# Altium project A540R260_Arm6.PrjPcb
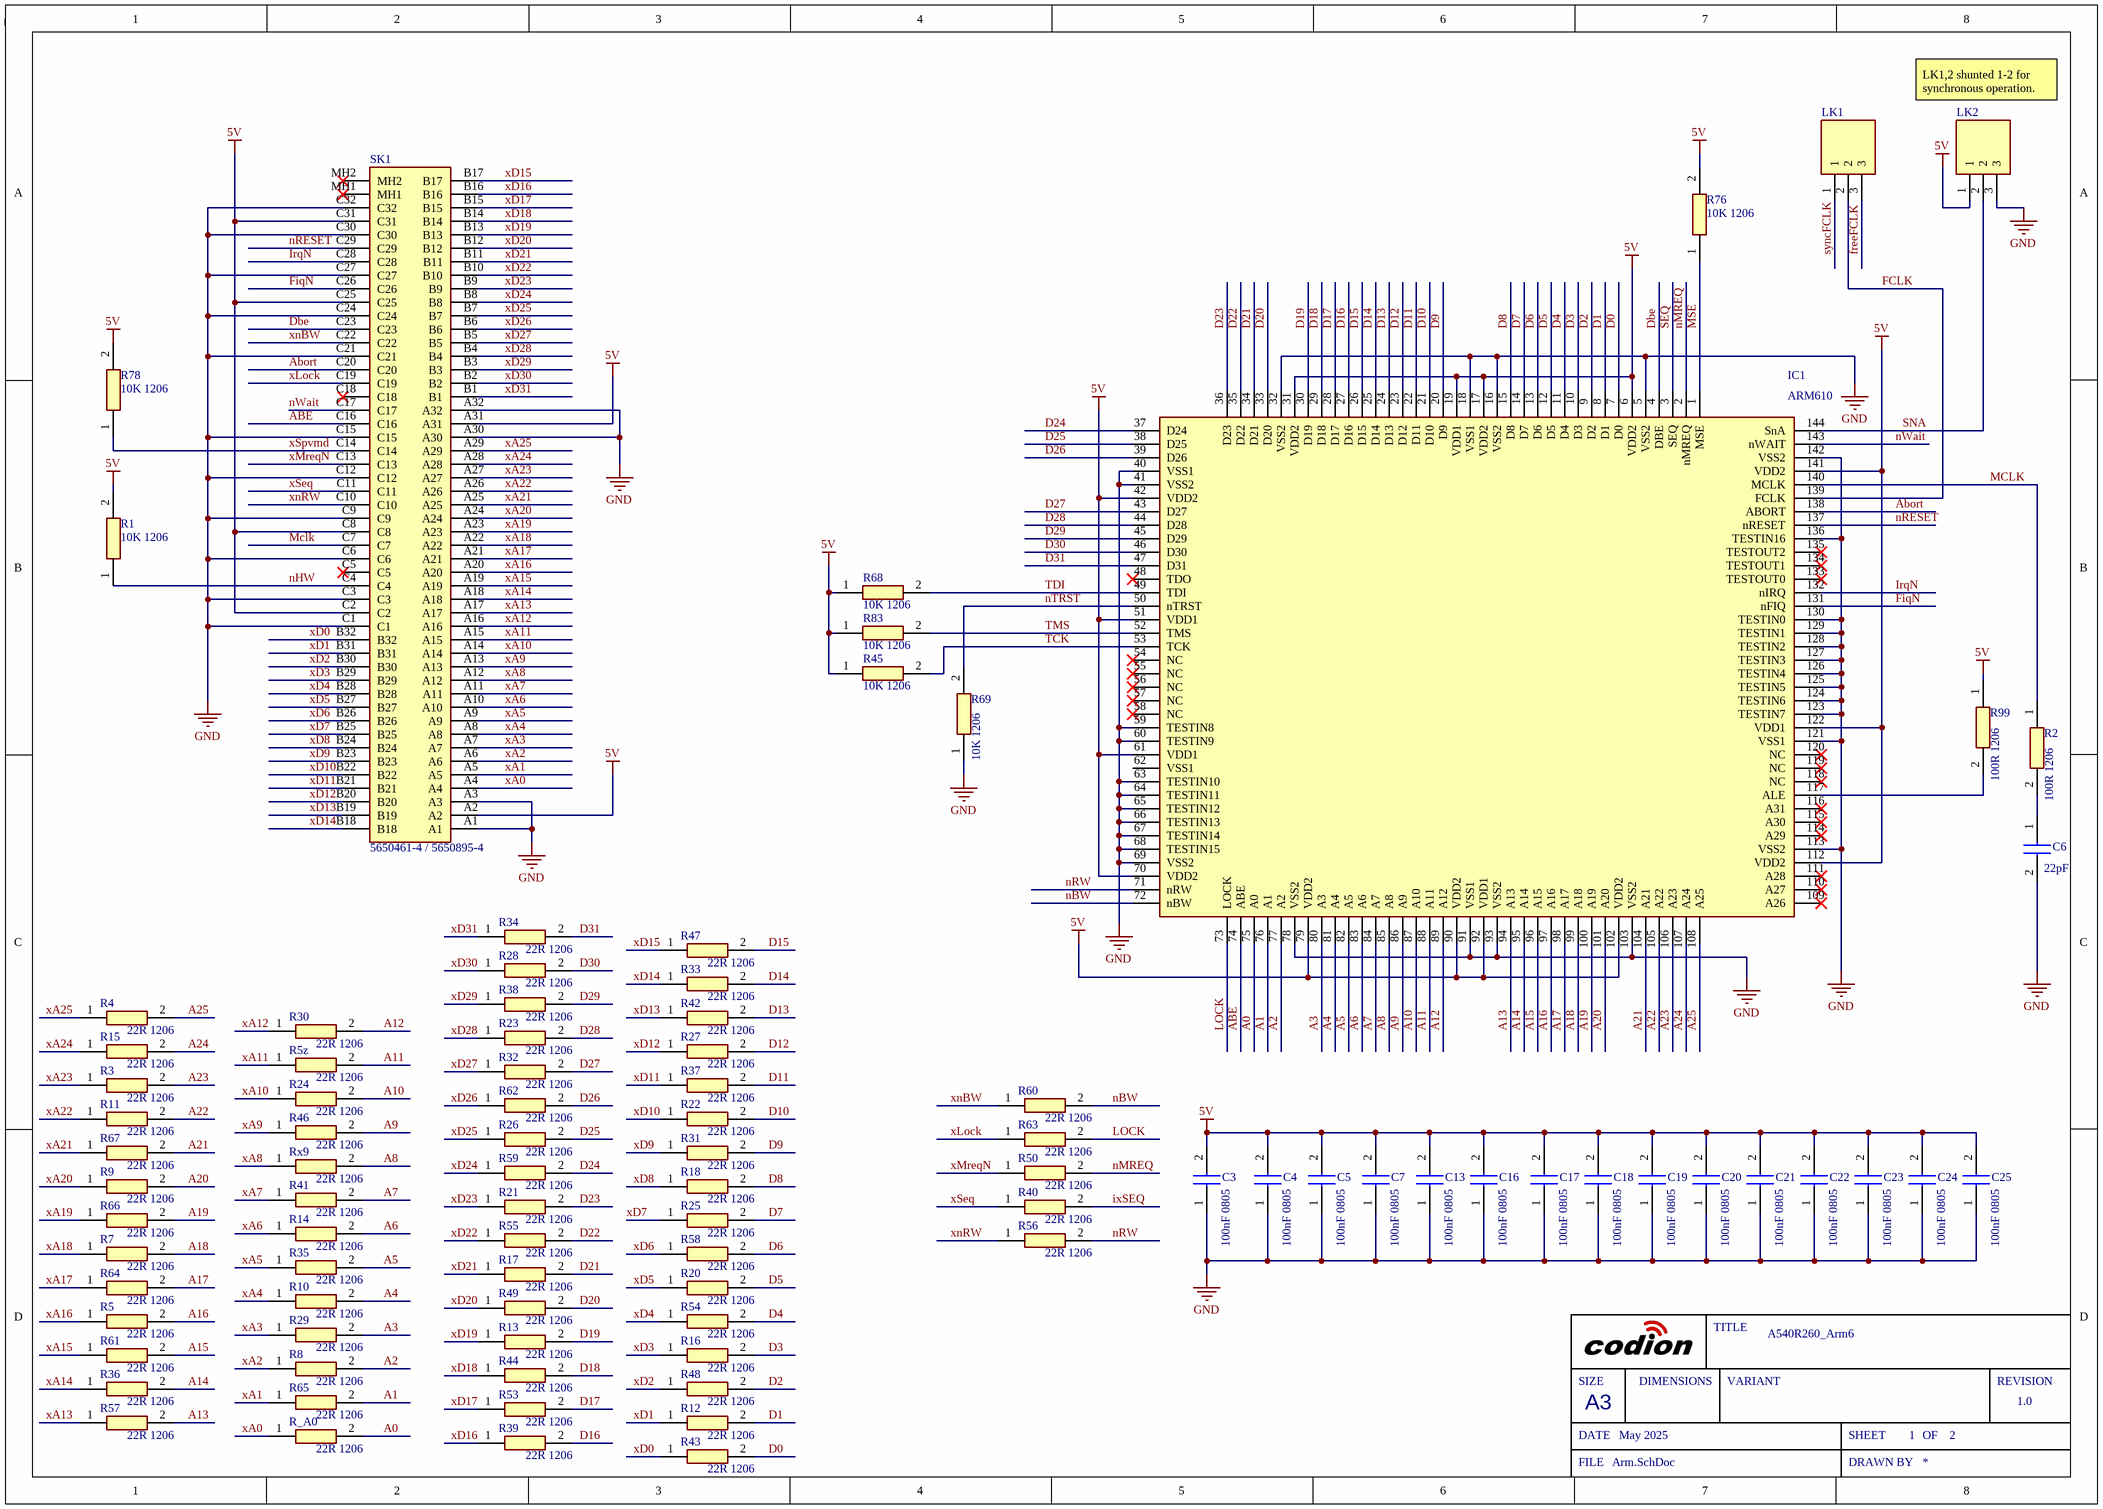
[diagram p0: Arm.SchDoc]
Sch_RevNo: 1.0; Sch_ReleaseDate: May 2025; Project_Title: A540R260_Arm6
2 sheets, 110 parts. Net scope: global (net labels, ports and power ports of the same name join across sheets).
Board file: A540R260_Arm6.PcbDoc
Sheets:
  Arm.SchDoc
  Glue.SchDoc

## Sheet Arm.SchDoc
size A3; SheetNumber: 1; SheetTotal: 2

### Parts
C3  100nF 0805  [CAPC2012X140N]
C4  100nF 0805  [CAPC2012X140N]
C5  100nF 0805  [CAPC2012X140N]
C6  22pF  [C0805]
C7  100nF 0805  [CAPC2012X140N]
C13  100nF 0805  [CAPC2012X140N]
C16  100nF 0805  [CAPC2012X140N]
C17  100nF 0805  [CAPC2012X140N]
C18  100nF 0805  [CAPC2012X140N]
C19  100nF 0805  [CAPC2012X140N]
C20  100nF 0805  [CAPC2012X140N]
C21  100nF 0805  [CAPC2012X140N]
C22  100nF 0805  [CAPC2012X140N]
C23  100nF 0805  [CAPC2012X140N]
C24  100nF 0805  [CAPC2012X140N]
C25  100nF 0805  [CAPC2012X140N]
IC1  ARM610  [TQFP144]
LK1  PREC003SAAN-RC  [HDRV3W64P0X254_1X3_762X254X868P]  (value not drawn)
LK2  PREC003SAAN-RC  [HDRV3W64P0X254_1X3_762X254X868P]  (value not drawn)
R1  10K 1206  [ERJUP8]
R2  100R 1206  [RESC3216X70N]
R3  22R 1206  [ERJUP8]
R4  22R 1206  [ERJUP8]
R5  22R 1206  [ERJUP8]
R5z  22R 1206  [ERJUP8]
R7  22R 1206  [ERJUP8]
R8  22R 1206  [ERJUP8]
R9  22R 1206  [ERJUP8]
R10  22R 1206  [ERJUP8]
R11  22R 1206  [ERJUP8]
R12  22R 1206  [ERJUP8]
R13  22R 1206  [ERJUP8]
R14  22R 1206  [ERJUP8]
R15  22R 1206  [ERJUP8]
R16  22R 1206  [ERJUP8]
R17  22R 1206  [ERJUP8]
R18  22R 1206  [ERJUP8]
R20  22R 1206  [ERJUP8]
R21  22R 1206  [ERJUP8]
R22  22R 1206  [ERJUP8]
R23  22R 1206  [ERJUP8]
R24  22R 1206  [ERJUP8]
R25  22R 1206  [ERJUP8]
R26  22R 1206  [ERJUP8]
R27  22R 1206  [ERJUP8]
R28  22R 1206  [ERJUP8]
R29  22R 1206  [ERJUP8]
R30  22R 1206  [ERJUP8]
R31  22R 1206  [ERJUP8]
R32  22R 1206  [ERJUP8]
R33  22R 1206  [ERJUP8]
R34  22R 1206  [ERJUP8]
R35  22R 1206  [ERJUP8]
R36  22R 1206  [ERJUP8]
R37  22R 1206  [ERJUP8]
R38  22R 1206  [ERJUP8]
R39  22R 1206  [ERJUP8]
R40  22R 1206  [ERJUP8]
R41  22R 1206  [ERJUP8]
R42  22R 1206  [ERJUP8]
R43  22R 1206  [ERJUP8]
R44  22R 1206  [ERJUP8]
R45  10K 1206  [ERJUP8]
R46  22R 1206  [ERJUP8]
R47  22R 1206  [ERJUP8]
R48  22R 1206  [ERJUP8]
R49  22R 1206  [ERJUP8]
R50  22R 1206  [ERJUP8]
R53  22R 1206  [ERJUP8]
R54  22R 1206  [ERJUP8]
R55  22R 1206  [ERJUP8]
R56  22R 1206  [ERJUP8]
R57  22R 1206  [ERJUP8]
R58  22R 1206  [ERJUP8]
R59  22R 1206  [ERJUP8]
R60  22R 1206  [ERJUP8]
R61  22R 1206  [ERJUP8]
R62  22R 1206  [ERJUP8]
R63  22R 1206  [ERJUP8]
R64  22R 1206  [ERJUP8]
R65  22R 1206  [ERJUP8]
R66  22R 1206  [ERJUP8]
R67  22R 1206  [ERJUP8]
R68  10K 1206  [ERJUP8]
R69  10K 1206  [ERJUP8]
R76  10K 1206  [ERJUP8]
R78  10K 1206  [ERJUP8]
R83  10K 1206  [ERJUP8]
R99  100R 1206  [RESC3216X70N]
R_A0  22R 1206  [ERJUP8]
Rx9  22R 1206  [ERJUP8]
SK1  5650461-4 / 5650895-4  [56504614]

### Nets
5V: C3.2 C4.2 C5.2 C7.2 C13.2 C16.2 C17.2 C18.2 C19.2 C20.2 C21.2 C22.2 C23.2 C24.2 C25.2 IC1.6(VDD2) IC1.17(VDD2) IC1.19(VDD1) IC1.31(VDD2) IC1.42(VDD2) IC1.51(VDD1) IC1.61(VDD1) IC1.70(VDD2) IC1.79(VDD2) IC1.90(VDD2) IC1.92(VDD1) IC1.102(VDD2) IC1.112(VDD2) IC1.122(VDD1) IC1.141(VDD2) LK2.1 R1.2 R45.1 R68.1 R76.2 R78.2 R83.1 R99.1 SK1.A2 SK1.A31 SK1.C2 SK1.C8 SK1.C25 SK1.C31
GND: C3.1 C4.1 C5.1 C6.2 C7.1 C13.1 C16.1 C17.1 C18.1 C19.1 C20.1 C21.1 C22.1 C23.1 C24.1 C25.1 IC1.5(VSS2) IC1.16(VSS2) IC1.18(VSS1) IC1.32(VSS2) IC1.40(VSS1) IC1.41(VSS2) IC1.59(TESTIN8) IC1.60(TESTIN9) IC1.63(TESTIN10) IC1.64(TESTIN11) IC1.65(TESTIN12) IC1.66(TESTIN13) IC1.67(TESTIN14) IC1.68(TESTIN15) IC1.69(VSS2) IC1.78(VSS2) IC1.91(VSS1) IC1.93(VSS2) IC1.103(VSS2) IC1.113(VSS2) IC1.121(VSS1) IC1.123(TESTIN7) IC1.124(TESTIN6) IC1.125(TESTIN5) IC1.126(TESTIN4) IC1.127(TESTIN3) IC1.128(TESTIN2) IC1.129(TESTIN1) IC1.130(TESTIN0) IC1.136(TESTIN16) IC1.142(VSS2) LK2.3 R69.1 SK1.A1 SK1.A3 SK1.A30 SK1.A32 SK1.C1 SK1.C3 SK1.C6 SK1.C9 SK1.C12 SK1.C15 SK1.C21 SK1.C24 SK1.C27 SK1.C30 SK1.C32
A0: IC1.75(A0) R_A0.2
A1: IC1.76(A1) R65.2
A2: IC1.77(A2) R8.2
A3: IC1.80(A3) R29.2
A4: IC1.81(A4) R10.2
A5: IC1.82(A5) R35.2
A6: IC1.83(A6) R14.2
A7: IC1.84(A7) R41.2
A8: IC1.85(A8) Rx9.2
A9: IC1.86(A9) R46.2
A10: IC1.87(A10) R24.2
A11: IC1.88(A11) R5z.2
A12: IC1.89(A12) R30.2
A13: IC1.94(A13) R57.2
A14: IC1.95(A14) R36.2
A15: IC1.96(A15) R61.2
A16: IC1.97(A16) R5.2
A17: IC1.98(A17) R64.2
A18: IC1.99(A18) R7.2
A19: IC1.100(A19) R66.2
A20: IC1.101(A20) R9.2
A21: IC1.104(A21) R67.2
A22: IC1.105(A22) R11.2
A23: IC1.106(A23) R3.2
A24: IC1.107(A24) R15.2
A25: IC1.108(A25) R4.2
ABE: IC1.74(ABE) SK1.C16
Abort: IC1.138(ABORT) SK1.C20
D0: IC1.7(D0) R43.2
D1: IC1.8(D1) R12.2
D2: IC1.9(D2) R48.2
D3: IC1.10(D3) R16.2
D4: IC1.11(D4) R54.2
D5: IC1.12(D5) R20.2
D6: IC1.13(D6) R58.2
D7: IC1.14(D7) R25.2
D8: IC1.15(D8) R18.2
D9: IC1.20(D9) R31.2
D10: IC1.21(D10) R22.2
D11: IC1.22(D11) R37.2
D12: IC1.23(D12) R27.2
D13: IC1.24(D13) R42.2
D14: IC1.25(D14) R33.2
D15: IC1.26(D15) R47.2
D16: IC1.27(D16) R39.2
D17: IC1.28(D17) R53.2
D18: IC1.29(D18) R44.2
D19: IC1.30(D19) R13.2
D20: IC1.33(D20) R49.2
D21: IC1.34(D21) R17.2
D22: IC1.35(D22) R55.2
D23: IC1.36(D23) R21.2
D24: IC1.37(D24) R59.2
D25: IC1.38(D25) R26.2
D26: IC1.39(D26) R62.2
D27: IC1.43(D27) R32.2
D28: IC1.44(D28) R23.2
D29: IC1.45(D29) R38.2
D30: IC1.46(D30) R28.2
D31: IC1.47(D31) R34.2
Dbe: IC1.4(DBE) SK1.C23
FCLK: IC1.139(FCLK) LK1.2
FiqN: IC1.131(nFIQ) SK1.C26
freeFCLK: LK1.3
IrqN: IC1.132(nIRQ) SK1.C28
ixSEQ: R40.2
LOCK: IC1.73(LOCK) R63.2
Mclk: IC1.140(MCLK) R2.1 SK1.C7
MSE: IC1.1(MSE) R76.1
nBW: IC1.72(nBW) R60.2
nHW: R1.1 SK1.C4
nMREQ: IC1.2(nMREQ) R50.2
nRESET: IC1.137(nRESET) SK1.C29
nRW: IC1.71(nRW) R56.2
nTRST: IC1.50(nTRST) R69.2
nWait: IC1.143(nWAIT) SK1.C17
SEQ: IC1.3(SEQ)
SNA: IC1.144(SnA) LK2.2
syncFCLK: LK1.1
TCK: IC1.53(TCK) R45.2
TDI: IC1.49(TDI) R68.2
TMS: IC1.52(TMS) R83.2
xA0: R_A0.1 SK1.A4
xA1: R65.1 SK1.A5
xA2: R8.1 SK1.A6
xA3: R29.1 SK1.A7
xA4: R10.1 SK1.A8
xA5: R35.1 SK1.A9
xA6: R14.1 SK1.A10
xA7: R41.1 SK1.A11
xA8: Rx9.1 SK1.A12
xA9: R46.1 SK1.A13
xA10: R24.1 SK1.A14
xA11: R5z.1 SK1.A15
xA12: R30.1 SK1.A16
xA13: R57.1 SK1.A17
xA14: R36.1 SK1.A18
xA15: R61.1 SK1.A19
xA16: R5.1 SK1.A20
xA17: R64.1 SK1.A21
xA18: R7.1 SK1.A22
xA19: R66.1 SK1.A23
xA20: R9.1 SK1.A24
xA21: R67.1 SK1.A25
xA22: R11.1 SK1.A26
xA23: R3.1 SK1.A27
xA24: R15.1 SK1.A28
xA25: R4.1 SK1.A29
xD0: R43.1 SK1.B32
xD1: R12.1 SK1.B31
xD2: R48.1 SK1.B30
xD3: R16.1 SK1.B29
xD4: R54.1 SK1.B28
xD5: R20.1 SK1.B27
xD6: R58.1 SK1.B26
xD7: R25.1 SK1.B25
xD8: R18.1 SK1.B24
xD9: R31.1 SK1.B23
xD10: R22.1 SK1.B22
xD11: R37.1 SK1.B21
xD12: R27.1 SK1.B20
xD13: R42.1 SK1.B19
xD14: R33.1 SK1.B18
xD15: R47.1 SK1.B17
xD16: R39.1 SK1.B16
xD17: R53.1 SK1.B15
xD18: R44.1 SK1.B14
xD19: R13.1 SK1.B13
xD20: R49.1 SK1.B12
xD21: R17.1 SK1.B11
xD22: R55.1 SK1.B10
xD23: R21.1 SK1.B9
xD24: R59.1 SK1.B8
xD25: R26.1 SK1.B7
xD26: R62.1 SK1.B6
xD27: R32.1 SK1.B5
xD28: R23.1 SK1.B4
xD29: R38.1 SK1.B3
xD30: R28.1 SK1.B2
xD31: R34.1 SK1.B1
xLock: R63.1 SK1.C19
xMreqN: R50.1 SK1.C13
xnBW: R60.1 SK1.C22
xnRW: R56.1 SK1.C10
xSeq: R40.1 SK1.C11
xSpvmd: R78.1 SK1.C14
NetC6_1: C6.1 R2.2
NetIC1_117: IC1.117(ALE) R99.2

Not connected (* = marked no-connect by the designer): IC1 48(TDO)* 54(NC)* 55(NC)* 56(NC)* 57(NC)* 58(NC)* 62(VSS1) 109(A26)* 110(A27)* 111(A28)* 114(A29)* 115(A30)* 116(A31)* 118(NC)* 119(NC)* 120(NC)* 133(TESTOUT0)* 134(TESTOUT1)* 135(TESTOUT2)*; SK1 C5* C18* MH1* MH2*

### Notes on the sheet
- LK1,2 shunted 1-2 for synchronous operation.
- SIZE
- DIMENSIONS
- TITLE
- VARIANT
- REVISION
- DATE
- A3
- SHEET
- OF
- FILE
- DRAWN BY

### Library data of the parts
C3-C5 C7 C13 C16-C25 = C0805C104J4JACAUTO: Capacitor; Manufacturer_Name: KEMET; Datasheet Link: https://content.kemet.com/datasheets/KEM_C1091_C0G_ESD.pdf; Height: 1.4mm; Manufacturer_Part_Number: C0805C104J4JACAUTO; Mouser Part Number: 80-C0805C104J4JAUTO; Mouser Price/Stock: https://www.mouser.co.uk/ProductDetail/KEMET/C0805C104J4JACAUTO?qs=MyNHzdoqoQKNICuQqAIXfA%3D%3D; Arrow Part Number: C0805C104J4JACAUTO; Arrow Price/Stock: https://www.arrow.com/en/products/c0805c104j4jacauto/kemet-corporation?region=nac
C6 = C0805X220K3GACTU: Capacitor; Manufacturer_Name: KEMET; Datasheet Link: https://content.kemet.com/datasheets/KEM_C1062_C0G_FT-CAP_SMD.pdf; Height: 1.1mm; Manufacturer_Part_Number: C0805X220K3GACTU
IC1 = VY86C610: Manufacturer_Name: VLSI; Manufacturer_Part_Number: VY86C610C; Height: 1.6mm
LK1 LK2 = PREC003SAAN-RC: Connector; Manufacturer_Name: Sullins; Datasheet Link: https://media.digikey.com/PDF/Data%20Sheets/Sullins%20PDFs/z%20RzCzzzSzzN-RC,%20ST,11635-B.pdf; Height: 8.68mm; Manufacturer_Part_Number: PREC003SAAN-RC
R1 R45 R68 R69 R76 R78 R83 = ERJ-UP8D1002V: Resistor; Manufacturer_Name: Panasonic; Datasheet Link: https://industrial.panasonic.com/cdbs/www-data/pdf/RDP0000/AOA0000C337.pdf; Height: 0.7mm; Manufacturer_Part_Number: ERJ-UP8D1002V
R2 R99 = ERA-8AEB101V: Resistor; Manufacturer_Name: Panasonic; Datasheet Link: https://industrial.panasonic.com/cdbs/www-data/pdf/RDM0000/AOA0000C307.pdf; Height: 0.7mm; Manufacturer_Part_Number: ERA-8AEB101V; Mouser Part Number: 667-ERA-8AEB101V; Mouser Price/Stock: https://www.mouser.co.uk/ProductDetail/Panasonic/ERA-8AEB101V?qs=Ojoo2rCVP9RpW8HgSjFLGA%3D%3D; Arrow Part Number: ERA-8AEB101V; Arrow Price/Stock: https://www.arrow.com/en/products/era8aeb101v/panasonic?region=europe
R3-R5 R5z R7-R18 R20-R44 R46-R50 R53-R67 R_A0 Rx9 = ERJ-UP8D22R0V: Resistor; Manufacturer_Name: Panasonic; Datasheet Link: https://industrial.panasonic.com/cdbs/www-data/pdf/RDP0000/AOA0000C337.pdf; Height: 0.7mm; Manufacturer_Part_Number: ERJ-UP8D22R0V
SK1 = 5650461-4: Connector; Manufacturer_Name: TE Connectivity; Datasheet Link: https://componentsearchengine.com/Datasheets/2/5650461-4.pdf; Height: 10.49mm; Manufacturer_Part_Number: 5650461-4; Mouser Part Number: 571-5650461-4; Mouser Price/Stock: https://www.mouser.co.uk/ProductDetail/TE-Connectivity/5650461-4?qs=xrnNvQC1SKQ%2FjdFwmiH0Uw%3D%3D; Arrow Part Number: 5650461-4; Arrow Price/Stock: https://www.arrow.com/en/products/5650461-4/te-connectivity

## Sheet Glue.SchDoc
size A3; SheetNumber: 2; SheetTotal: 2
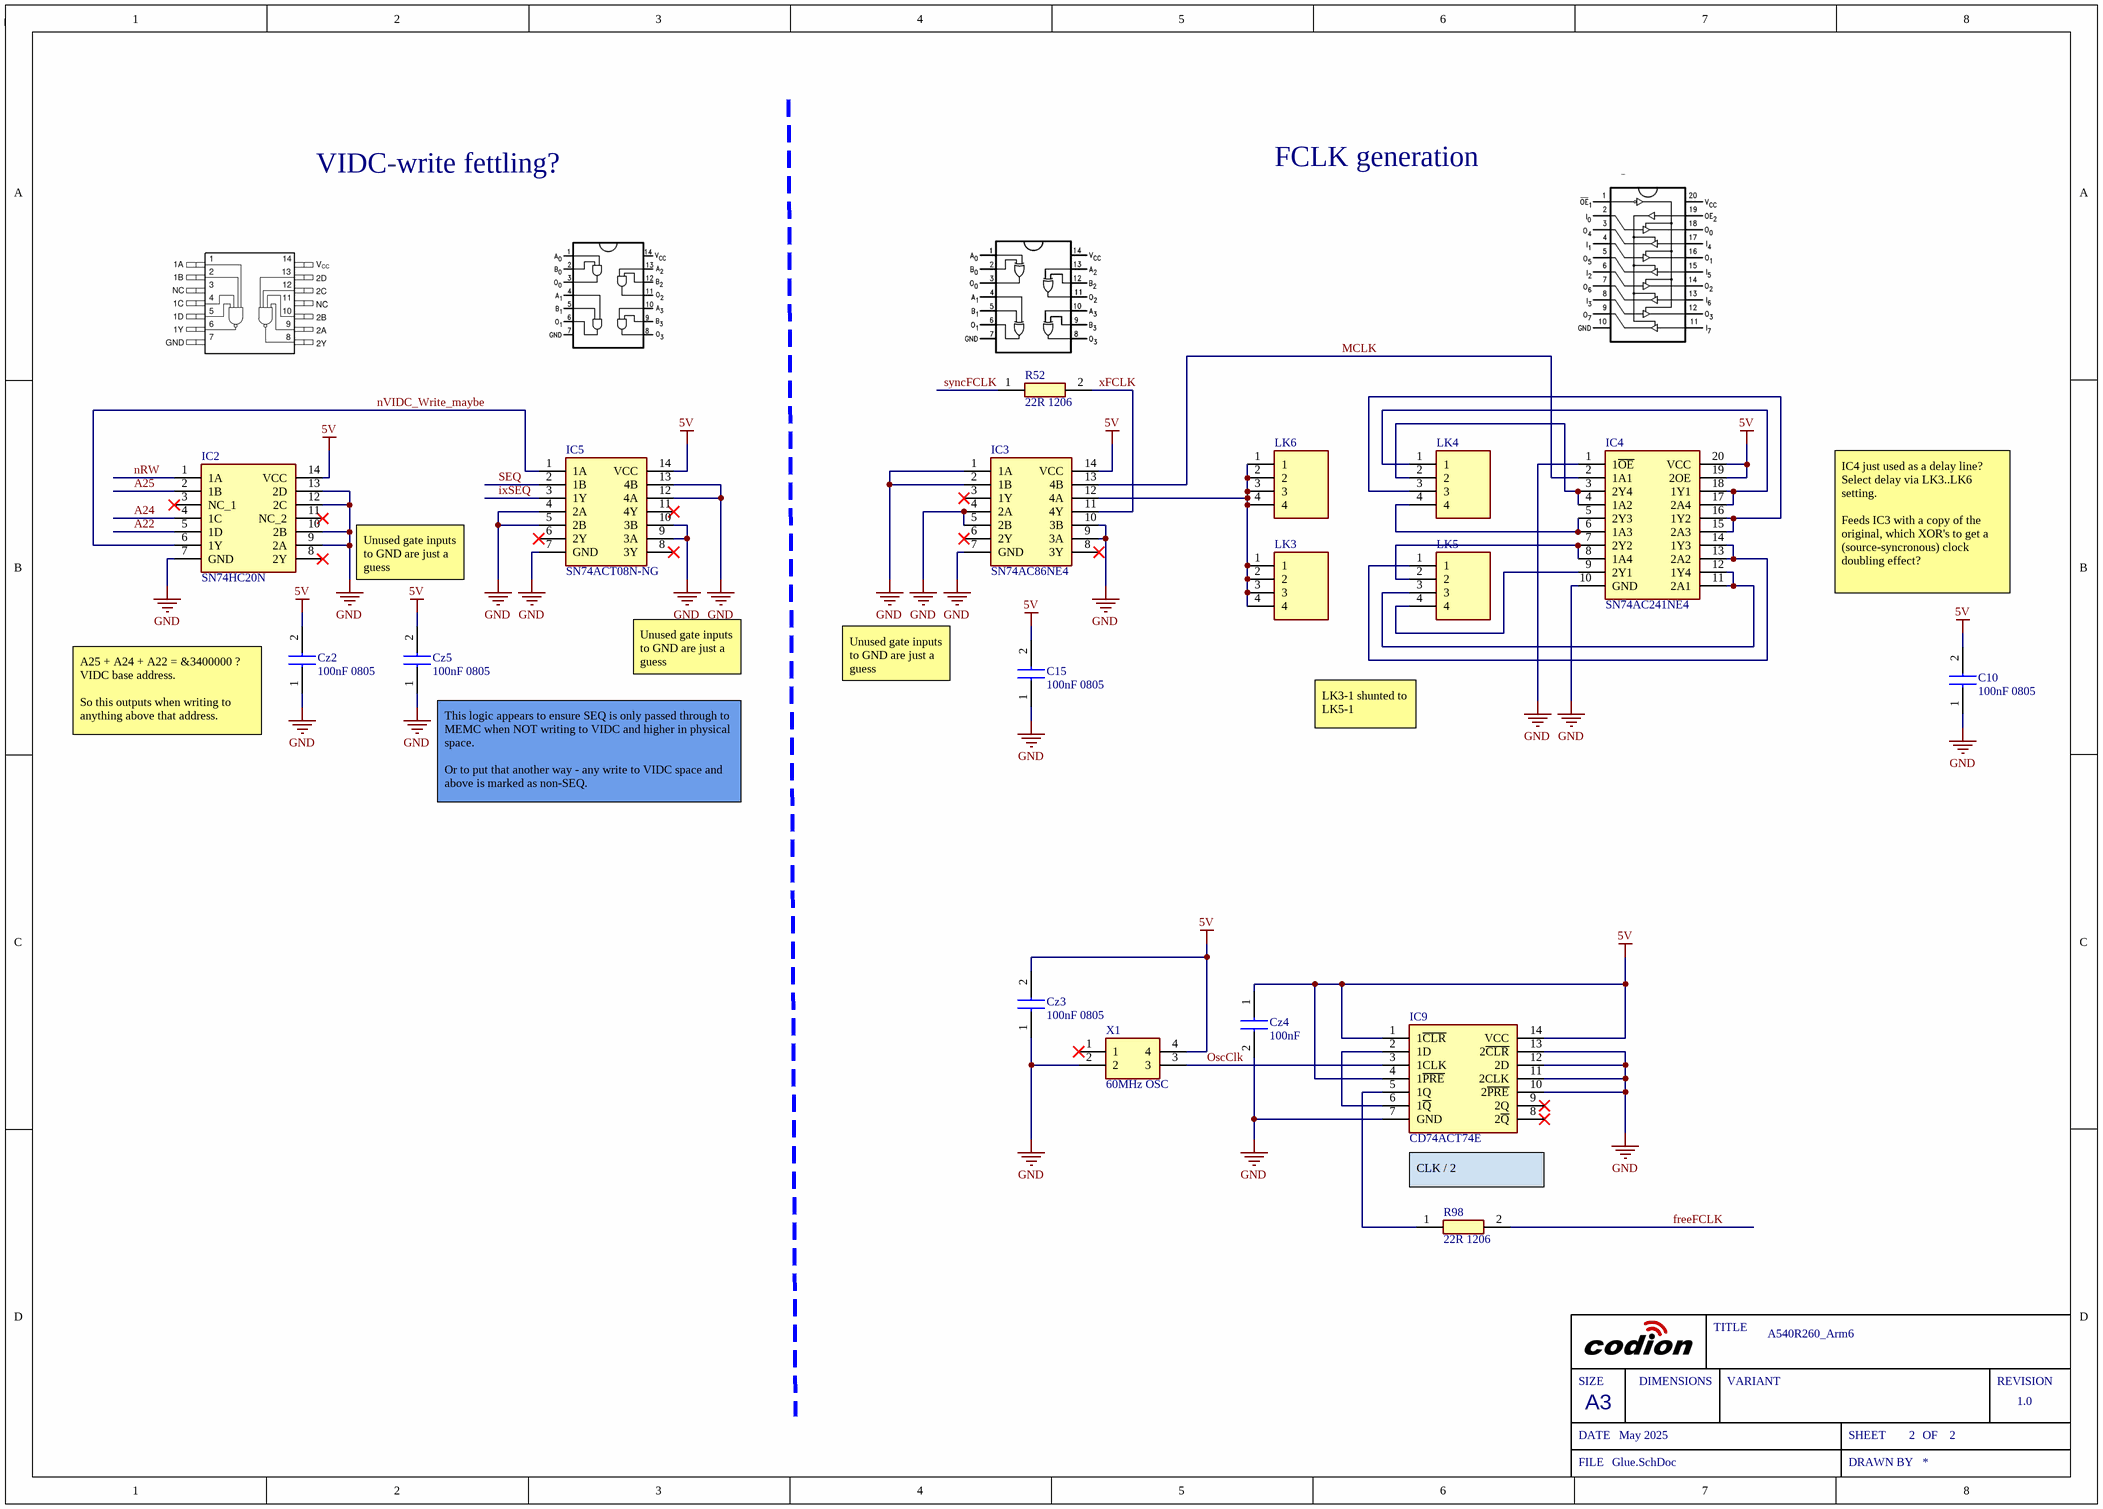
[diagram p1: Glue.SchDoc]

### Parts
C10  100nF 0805  [CAPC2012X140N]
C15  100nF 0805  [CAPC2012X140N]
Cz2  100nF 0805  [CAPC2012X140N]
Cz3  100nF 0805  [CAPC2012X140N]
Cz4  100nF  [CAPC2012X145N]
Cz5  100nF 0805  [CAPC2012X140N]
IC2  SN74HC20N  [DIP794W53P254L1930H508Q14N]
IC3  SN74AC86NE4  [DIP794W53P254L1930H508Q14N]
IC4  SN74AC241NE4  [DIP794W53P254L2540H508Q20N]
IC5  SN74ACT08N-NG  [DIP794W53P254L1930H508Q14N]
IC9  CD74ACT74E  [DIP794W53P254L1930H508Q14N]
LK3  PREC004SAAN-RC  [HDRV4W64P0X254_1X4_1016X254X854P]  (value not drawn)
LK4  PREC004SAAN-RC  [HDRV4W64P0X254_1X4_1016X254X854P]  (value not drawn)
LK5  PREC004SAAN-RC  [HDRV4W64P0X254_1X4_1016X254X854P]  (value not drawn)
LK6  PREC004SAAN-RC  [HDRV4W64P0X254_1X4_1016X254X854P]  (value not drawn)
R52  22R 1206  [ERJUP8]
R98  22R 1206  [ERJUP8]
X1  60MHz OSC  [DIPS762W56P1524L1778H241Q4N]

### Nets
5V: C10.2 C15.2 Cz2.2 Cz3.2 Cz4.1 Cz5.2 IC2.14(VCC) IC3.14(VCC) IC4.19(2OE) IC4.20(VCC) IC5.14(VCC) IC9.1(1~{CLR}) IC9.4(1~{PRE}) IC9.14(VCC) X1.4
GND: C10.1 C15.1 Cz2.1 Cz3.1 Cz4.2 Cz5.1 IC2.7(GND) IC2.9(2A) IC2.10(2B) IC2.12(2C) IC2.13(2D) IC3.1(1A) IC3.2(1B) IC3.4(2A) IC3.5(2B) IC3.7(GND) IC3.9(3A) IC3.10(3B) IC4.1(1~{OE}) IC4.10(GND) IC5.4(2A) IC5.5(2B) IC5.7(GND) IC5.9(3A) IC5.10(3B) IC5.12(4A) IC5.13(4B) IC9.7(GND) IC9.10(2~{PRE}) IC9.11(2CLK) IC9.12(2D) IC9.13(2~{CLR}) X1.2
A22: IC2.5(1D)
A24: IC2.4(1C)
A25: IC2.2(1B)
freeFCLK: R98.2
ixSEQ: IC5.3(1Y)
Mclk: IC3.13(4B) IC4.2(1A1)
nRW: IC2.1(1A)
nVIDC_Write_maybe: IC2.6(1Y) IC5.1(1A)
OscClk: IC9.3(1CLK) X1.3
SEQ: IC5.2(1B)
syncFCLK: R52.1
xFCLK: IC3.11(4Y) R52.2
NetIC3_12: IC3.12(4A) LK3.1 LK3.2 LK3.3 LK3.4 LK6.1 LK6.2 LK6.3 LK6.4
NetIC4_3: IC4.3(2Y4) IC4.4(1A2) LK4.2
NetIC4_5: IC4.5(2Y3) IC4.6(1A3) LK4.4
NetIC4_7: IC4.7(2Y2) IC4.8(1A4) LK5.2
NetIC4_9: IC4.9(2Y1) LK5.4
NetIC4_11: IC4.11(2A1) IC4.12(1Y4) LK5.3
NetIC4_13: IC4.13(2A2) IC4.14(1Y3) LK5.1
NetIC4_15: IC4.15(2A3) IC4.16(1Y2) LK4.3
NetIC4_17: IC4.17(2A4) IC4.18(1Y1) LK4.1
NetIC9_2: IC9.2(1D) IC9.6(1~{Q})
NetIC9_5: IC9.5(1Q) R98.1

Not connected (* = marked no-connect by the designer): IC2 3(NC_1)* 8(2Y)* 11(NC_2)*; IC3 3(1Y)* 6(2Y)* 8(3Y)*; IC5 6(2Y)* 8(3Y)* 11(4Y)*; IC9 8(2~{Q})* 9(2Q)*; X1 1*

### Notes on the sheet
- VIDC-write fettling?
- FCLK generation
- Unused gate inputs to GND are just a guess
- IC4 just used as a delay line?   Select delay via LK3..LK6 setting.
  Feeds IC3 with a copy of the original, which XOR's to get a (source-syncronous) clock doubling effect?
- LK3-1 shunted to LK5-1
- (near Cz2) A25 + A24 + A22 = &3400000 ?  VIDC base address.
  So this outputs when writing to anything above that address.
- (near Cz5) This logic appears to ensure SEQ is only passed through to MEMC when NOT writing to VIDC and higher in physical space.
  Or to put that another way - any write to VIDC space and above is marked as non-SEQ.
- CLK / 2
- SIZE
- DIMENSIONS
- TITLE
- VARIANT
- REVISION
- DATE
- A3
- SHEET
- OF
- FILE
- DRAWN BY

### Library data of the parts
C10 C15 Cz2 Cz3 Cz5 = C0805C104J4JACAUTO: Capacitor; Manufacturer_Name: KEMET; Datasheet Link: https://content.kemet.com/datasheets/KEM_C1091_C0G_ESD.pdf; Height: 1.4mm; Manufacturer_Part_Number: C0805C104J4JACAUTO; Mouser Part Number: 80-C0805C104J4JAUTO; Mouser Price/Stock: https://www.mouser.co.uk/ProductDetail/KEMET/C0805C104J4JACAUTO?qs=MyNHzdoqoQKNICuQqAIXfA%3D%3D; Arrow Part Number: C0805C104J4JACAUTO; Arrow Price/Stock: https://www.arrow.com/en/products/c0805c104j4jacauto/kemet-corporation?region=nac
Cz4 = C2012X7R1H104K125AM: Capacitor; Manufacturer_Name: TDK; Datasheet Link: https://product.tdk.com/info/en/catalog/datasheets/mlcc_commercial_midvoltage_en.pdf; Height: 1.45mm; Manufacturer_Part_Number: C2012X7R1H104K125AM; Mouser Part Number: 810-C2012X7R1H104KT5; Mouser Price/Stock: https://www.mouser.com/Search/Refine.aspx?Keyword=810-C2012X7R1H104KT5; Arrow Part Number: C2012X7R1H104K125AM; Arrow Price/Stock: https://www.arrow.com/en/products/c2012x7r1h104k125am/tdk
IC2 = SN74HC20N: Integrated Circuit; Manufacturer_Name: Texas Instruments; Datasheet Link: http://www.ti.com/lit/gpn/sn74hc20; Height: 5.08mm; Manufacturer_Part_Number: SN74HC20N; Mouser Part Number: 595-SN74HC20N; Mouser Price/Stock: https://www.mouser.co.uk/ProductDetail/Texas-Instruments/SN74HC20N?qs=pt%2FIv5r0EPf8TTavFR1q%252Bw%3D%3D; Arrow Part Number: SN74HC20N; Arrow Price/Stock: https://www.arrow.com/en/products/sn74hc20n/texas-instruments
IC3 = SN74AC86NE4: Integrated Circuit; Manufacturer_Name: Texas Instruments; Datasheet Link: https://www.ti.com/lit/ds/symlink/sn74ac86.pdf?HQS=dis-dk-null-digikeymode-dsf-pf-null-wwe&ts=1642844260121&ref_url=https%253A%252F%252Fwww.ti.com%252Fgeneral%252Fdocs%252Fsuppproductinfo.tsp%253FdistId%253D10%2526gotoUrl%253Dhttps%253A%252F%252Fwww.ti.co; Height: 5.08mm; Manufacturer_Part_Number: SN74AC86NE4
IC4 = SN74AC241NE4: Integrated Circuit; Manufacturer_Name: Texas Instruments; Datasheet Link: https://www.ti.com/lit/ds/scas513e/scas513e.pdf; Height: 5.08mm; Manufacturer_Part_Number: SN74AC241NE4; Arrow Part Number: SN74AC241NE4; Arrow Price/Stock: https://www.arrow.com/en/products/sn74ac241ne4/texas-instruments
IC5 = SN74ACT08N-NG: Integrated Circuit; Manufacturer_Name: Texas Instruments; Datasheet Link: https://www.ti.com/lit/ds/symlink/sn74act08.pdf?HQS=dis-mous-null-mousermode-dsf-pf-null-wwe&ts=1653633689080&ref_url=https%253A%252F%252Fwww.mouser.in%252F; Height: 5.08mm; Manufacturer_Part_Number: SN74ACT08N-NG
IC9 = CD74ACT74E: Integrated Circuit; Manufacturer_Name: Texas Instruments; Datasheet Link: http://www.ti.com/lit/ds/symlink/cd74act74.pdf; Height: 5.08mm; Manufacturer_Part_Number: CD74ACT74E; Mouser Part Number: 595-CD74ACT74E; Mouser Price/Stock: https://www.mouser.co.uk/ProductDetail/Texas-Instruments/CD74ACT74E?qs=KaAwwOlwapulo9KBjJbamw%3D%3D; Arrow Part Number: CD74ACT74E; Arrow Price/Stock: https://www.arrow.com/en/products/cd74act74e/texas-instruments?region=nac
LK3-LK6 = PREC004SAAN-RC: Connector; Manufacturer_Name: Sullins; Datasheet Link: https://drawings-pdf.s3.amazonaws.com/11635.pdf; Height: 8.54mm; Manufacturer_Part_Number: PREC004SAAN-RC
R52 R98 = ERJ-UP8D22R0V: Resistor; Manufacturer_Name: Panasonic; Datasheet Link: https://industrial.panasonic.com/cdbs/www-data/pdf/RDP0000/AOA0000C337.pdf; Height: 0.7mm; Manufacturer_Part_Number: ERJ-UP8D22R0V
X1 = 1107741: Manufacturer_Name: ARIES; Datasheet Link: http://docs-emea.rs-online.com/webdocs/13f3/0900766b813f3237.pdf; Height: 2.41mm; Manufacturer_Part_Number: 1107741; Mouser Part Number: 535-1107741; Mouser Price/Stock: https://www.mouser.co.uk/ProductDetail/Aries-Electronics/1107741?qs=WZRMhwwaLl%2FApwqojhfzdA%3D%3D

## Nets that join several sheets
5V: Arm (44 pins), Glue (15 pins)
GND: Arm (64 pins), Glue (33 pins)
A22: Arm (IC1.105 R11.2), Glue (IC2.5)
A24: Arm (IC1.107 R15.2), Glue (IC2.4)
A25: Arm (IC1.108 R4.2), Glue (IC2.2)
freeFCLK: Arm (LK1.3), Glue (R98.2)
ixSEQ: Arm (R40.2), Glue (IC5.3)
Mclk: Arm (IC1.140 R2.1 SK1.C7), Glue (IC3.13 IC4.2)
nRW: Arm (IC1.71 R56.2), Glue (IC2.1)
SEQ: Arm (IC1.3), Glue (IC5.2)
syncFCLK: Arm (LK1.1), Glue (R52.1)